# Altium project PROC154E3_SCH.PrjPcb (part 13 of 60)

## Sheet 22. SOC ANALOG POWER 1.SchDoc: SOC - ANALOG POWER 1
size 513 x 386 mm; Project: PROC154E2(001)_SK_AM69; Issue: 1.0; RevCode: E3; Page Create Date: March  8, 1995; Variant Name: Core Design; Schematic Page Number: 22; Page Number: 22; Page Size: C; Comment: MISTRAL_TITLEBLK_CSIZE_1; Page Count: 62; Schematic Page Count: 62; Name: PROC154E2 001 SK AM69; DsnPath: C:\Users\danie\Downloads\sprr466c\PROC154E3_RP\PROC154E3_SCH.DSN; SchematicName: SCHEMATIC1; PageName: 22. SOC ANALOG POWER 1; PageSize: C; TopSchematic: True
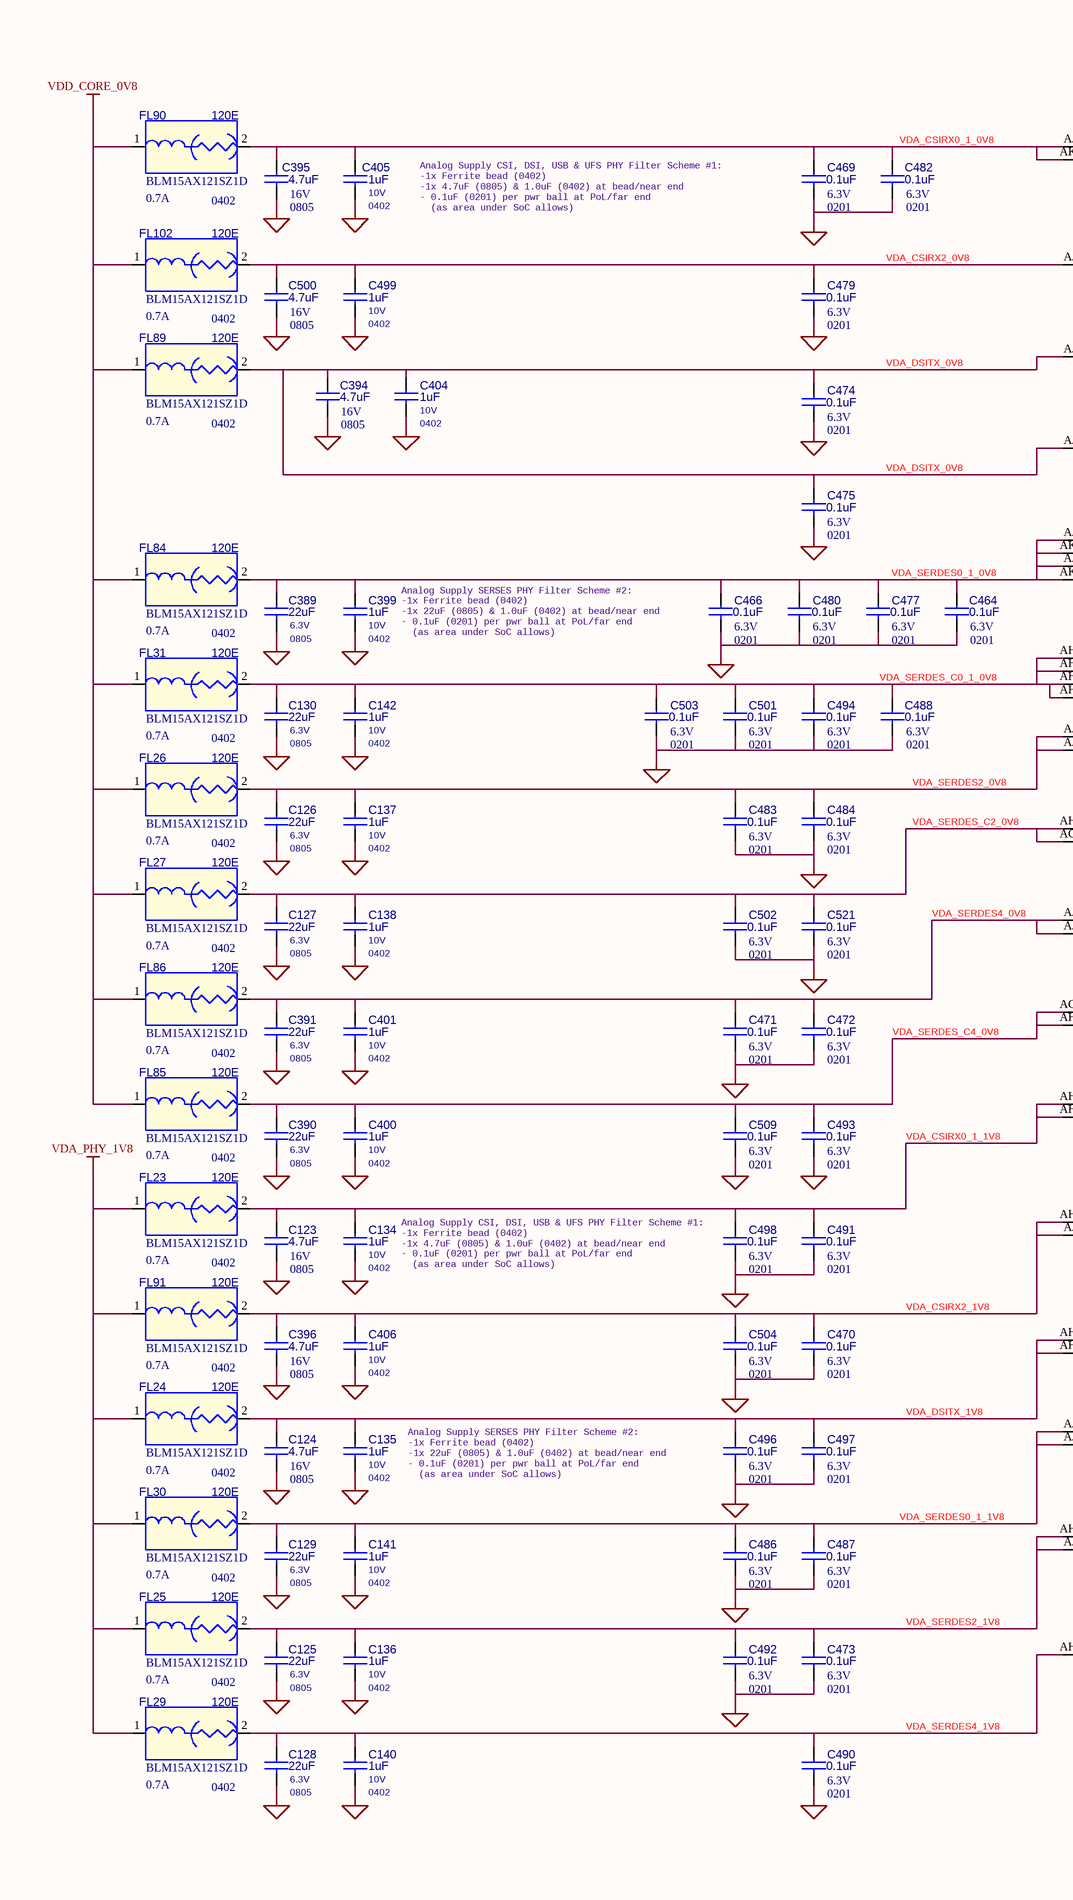
[diagram p32: 22. SOC ANALOG POWER 1.SchDoc, left]
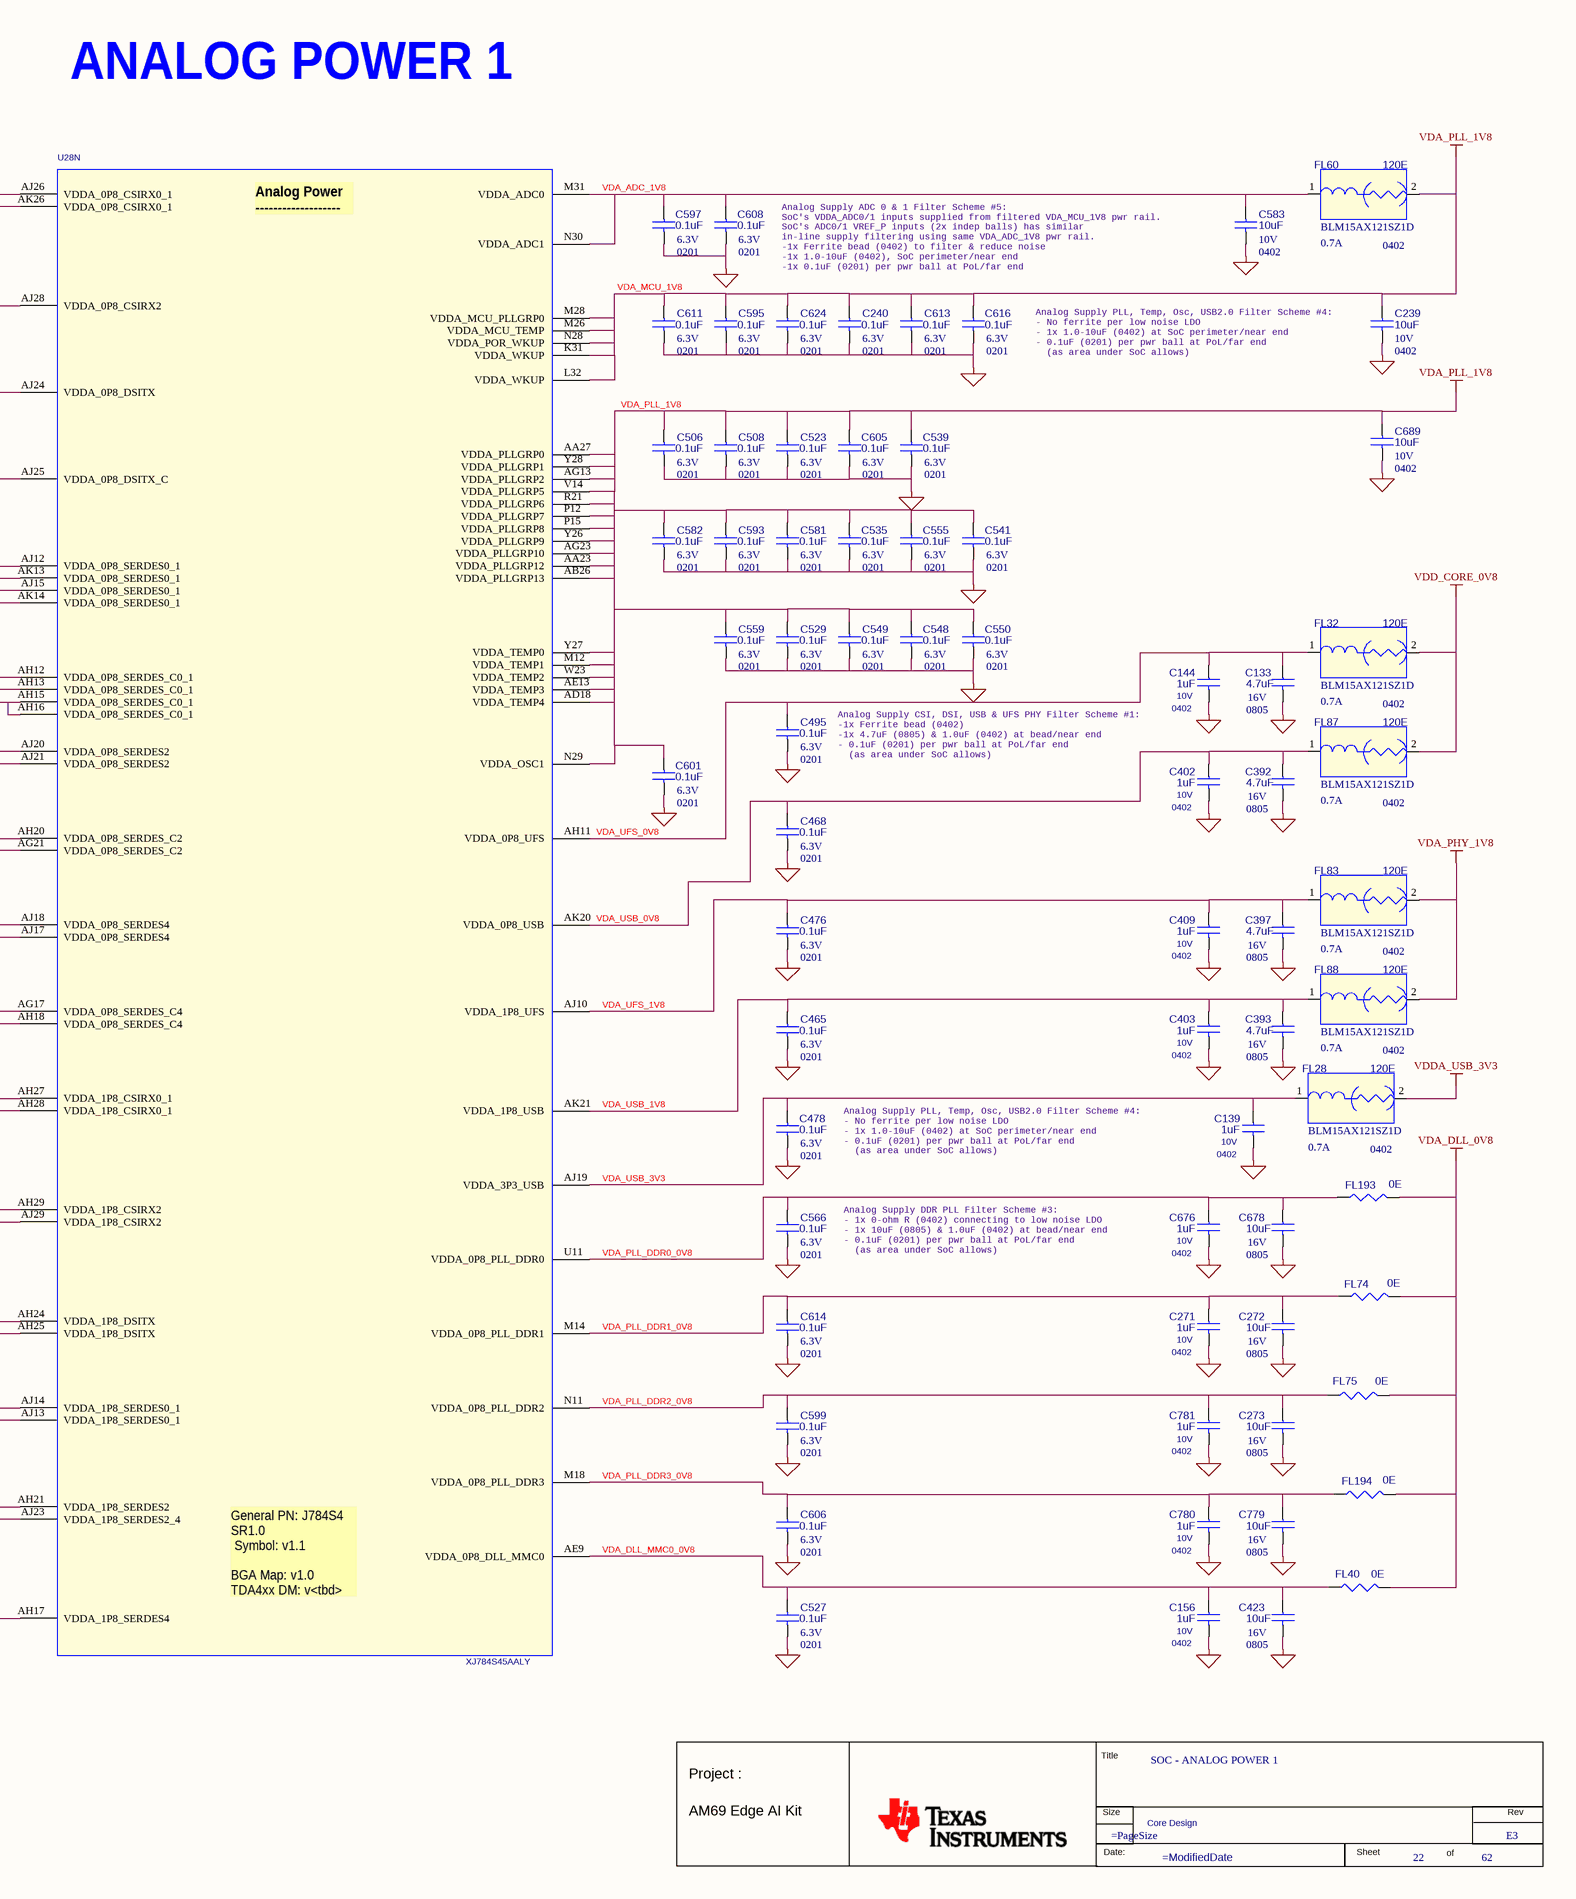
[diagram p33: 22. SOC ANALOG POWER 1.SchDoc, right]

### Parts
(Parts that share a designator on the sheet are numbered #1, #2 ... from top to bottom, then left to right.)
*#22  RevCode: E3  Title: SOC - ANALOG POWER 1  Page Number: 22  Page Count: 62  Variant Name: Core Design  (hidden comment: MISTRAL_TITLEBLK_CSIZE_1)  (graphical)
C123  4.7uF  Package: 0805  Voltage: 16V  [CAP0805_1-5]
C124  4.7uF  Package: 0805  Voltage: 16V  [CAP0805_1-5]
C125  22uF  Voltage: 6.3V  Package: 0805  [CAP0805_1-25]
C126  22uF  Package: 0805  Voltage: 6.3V  [CAP0805_1-25]
C127  22uF  Package: 0805  Voltage: 6.3V  [CAP0805_1-25]
C128  22uF  Package: 0805  Voltage: 6.3V  [CAP0805_1-25]
C129  22uF  Voltage: 6.3V  Package: 0805  [CAP0805_1-25]
C130  22uF  Package: 0805  Voltage: 6.3V  [CAP0805_1-25]
C133  4.7uF  Voltage: 16V  Package: 0805  [CAP0805_1-5]
C134  1uF  Voltage: 10V  Package: 0402  [CAP0402_0-75]
C135  1uF  Voltage: 10V  Package: 0402  [CAP0402_0-75]
C136  1uF  Package: 0402  Voltage: 10V  [CAP0402_0-75]
C137  1uF  Package: 0402  Voltage: 10V  [CAP0402_0-75]
C138  1uF  Voltage: 10V  Package: 0402  [CAP0402_0-75]
C139  1uF  Voltage: 10V  Package: 0402  [CAP0402_0-75]
C140  1uF  Voltage: 10V  Package: 0402  [CAP0402_0-75]
C141  1uF  Package: 0402  Voltage: 10V  [CAP0402_0-75]
C142  1uF  Package: 0402  Voltage: 10V  [CAP0402_0-75]
C144  1uF  Package: 0402  Voltage: 10V  [CAP0402_0-75]
C156  1uF  Voltage: 10V  Package: 0402  [CAP0402_0-75]
C239  10uF  Package: 0402  Voltage: 10V  [CAP0402_0-75]
C240  0.1uF  Voltage: 6.3V  Package: 0201  [CAP0201_0-5]
C271  1uF  Voltage: 10V  Package: 0402  [CAP0402_0-75]
C272  10uF  Voltage: 16V  Package: 0805  [CAP0805_1-5]
C273  10uF  Voltage: 16V  Package: 0805  [CAP0805_1-5]
C389  22uF  Package: 0805  Voltage: 6.3V  [CAP0805_1-25]
C390  22uF  Voltage: 6.3V  Package: 0805  [CAP0805_1-25]
C391  22uF  Package: 0805  Voltage: 6.3V  [CAP0805_1-25]
C392  4.7uF  Voltage: 16V  Package: 0805  [CAP0805_1-5]
C393  4.7uF  Voltage: 16V  Package: 0805  [CAP0805_1-5]
C394  4.7uF  Package: 0805  Voltage: 16V  [CAP0805_1-5]
C395  4.7uF  Voltage: 16V  Package: 0805  [CAP0805_1-5]
C396  4.7uF  Voltage: 16V  Package: 0805  [CAP0805_1-5]
C397  4.7uF  Voltage: 16V  Package: 0805  [CAP0805_1-5]
C399  1uF  Voltage: 10V  Package: 0402  [CAP0402_0-75]
C400  1uF  Package: 0402  Voltage: 10V  [CAP0402_0-75]
C401  1uF  Voltage: 10V  Package: 0402  [CAP0402_0-75]
C402  1uF  Package: 0402  Voltage: 10V  [CAP0402_0-75]
C403  1uF  Package: 0402  Voltage: 10V  [CAP0402_0-75]
C404  1uF  Package: 0402  Voltage: 10V  [CAP0402_0-75]
C405  1uF  Package: 0402  Voltage: 10V  [CAP0402_0-75]
C406  1uF  Package: 0402  Voltage: 10V  [CAP0402_0-75]
C409  1uF  Package: 0402  Voltage: 10V  [CAP0402_0-75]
C423  10uF  Voltage: 16V  Package: 0805  [CAP0805_1-5]
C464  0.1uF  Package: 0201  Voltage: 6.3V  [CAP0201_0-5]
C465  0.1uF  Voltage: 6.3V  Package: 0201  [CAP0201_0-5]
C466  0.1uF  Package: 0201  Voltage: 6.3V  [CAP0201_0-5]
C468  0.1uF  Voltage: 6.3V  Package: 0201  [CAP0201_0-5]
C469  0.1uF  Voltage: 6.3V  Package: 0201  [CAP0201_0-5]
C470  0.1uF  Voltage: 6.3V  Package: 0201  [CAP0201_0-5]
C471  0.1uF  Voltage: 6.3V  Package: 0201  [CAP0201_0-5]
C472  0.1uF  Package: 0201  Voltage: 6.3V  [CAP0201_0-5]
C473  0.1uF  Voltage: 6.3V  Package: 0201  [CAP0201_0-5]
C474  0.1uF  Package: 0201  Voltage: 6.3V  [CAP0201_0-5]
C475  0.1uF  Voltage: 6.3V  Package: 0201  [CAP0201_0-5]
C476  0.1uF  Voltage: 6.3V  Package: 0201  [CAP0201_0-5]
C477  0.1uF  Voltage: 6.3V  Package: 0201  [CAP0201_0-5]
C478  0.1uF  Package: 0201  Voltage: 6.3V  [CAP0201_0-5]
C479  0.1uF  Voltage: 6.3V  Package: 0201  [CAP0201_0-5]
C480  0.1uF  Package: 0201  Voltage: 6.3V  [CAP0201_0-5]
C482  0.1uF  Voltage: 6.3V  Package: 0201  [CAP0201_0-5]
C483  0.1uF  Package: 0201  Voltage: 6.3V  [CAP0201_0-5]
C484  0.1uF  Package: 0201  Voltage: 6.3V  [CAP0201_0-5]
C486  0.1uF  Voltage: 6.3V  Package: 0201  [CAP0201_0-5]
C487  0.1uF  Voltage: 6.3V  Package: 0201  [CAP0201_0-5]
C488  0.1uF  Voltage: 6.3V  Package: 0201  [CAP0201_0-5]
C490  0.1uF  Voltage: 6.3V  Package: 0201  [CAP0201_0-5]
C491  0.1uF  Package: 0201  Voltage: 6.3V  [CAP0201_0-5]
C492  0.1uF  Voltage: 6.3V  Package: 0201  [CAP0201_0-5]
C493  0.1uF  Voltage: 6.3V  Package: 0201  [CAP0201_0-5]
C494  0.1uF  Package: 0201  Voltage: 6.3V  [CAP0201_0-5]
C495  0.1uF  Voltage: 6.3V  Package: 0201  [CAP0201_0-5]
C496  0.1uF  Package: 0201  Voltage: 6.3V  [CAP0201_0-5]
C497  0.1uF  Voltage: 6.3V  Package: 0201  [CAP0201_0-5]
C498  0.1uF  Voltage: 6.3V  Package: 0201  [CAP0201_0-5]
C499  1uF  Package: 0402  Voltage: 10V  [CAP0402_0-75]
C500  4.7uF  Package: 0805  Voltage: 16V  [CAP0805_1-5]
C501  0.1uF  Voltage: 6.3V  Package: 0201  [CAP0201_0-5]
C502  0.1uF  Package: 0201  Voltage: 6.3V  [CAP0201_0-5]
C503  0.1uF  Voltage: 6.3V  Package: 0201  [CAP0201_0-5]
C504  0.1uF  Package: 0201  Voltage: 6.3V  [CAP0201_0-5]
C506  0.1uF  Voltage: 6.3V  Package: 0201  [CAP0201_0-5]
C508  0.1uF  Voltage: 6.3V  Package: 0201  [CAP0201_0-5]
C509  0.1uF  Package: 0201  Voltage: 6.3V  [CAP0201_0-5]
C521  0.1uF  Voltage: 6.3V  Package: 0201  [CAP0201_0-5]
C523  0.1uF  Voltage: 6.3V  Package: 0201  [CAP0201_0-5]
C527  0.1uF  Package: 0201  Voltage: 6.3V  [CAP0201_0-5]
C529  0.1uF  Package: 0201  Voltage: 6.3V  [CAP0201_0-5]
C535  0.1uF  Package: 0201  Voltage: 6.3V  [CAP0201_0-5]
C539  0.1uF  Package: 0201  Voltage: 6.3V  [CAP0201_0-5]
C541  0.1uF  Voltage: 6.3V  Package: 0201  [CAP0201_0-5]
C548  0.1uF  Package: 0201  Voltage: 6.3V  [CAP0201_0-5]
C549  0.1uF  Voltage: 6.3V  Package: 0201  [CAP0201_0-5]
C550  0.1uF  Voltage: 6.3V  Package: 0201  [CAP0201_0-5]
C555  0.1uF  Package: 0201  Voltage: 6.3V  [CAP0201_0-5]
C559  0.1uF  Voltage: 6.3V  Package: 0201  [CAP0201_0-5]
C566  0.1uF  Package: 0201  Voltage: 6.3V  [CAP0201_0-5]
C581  0.1uF  Voltage: 6.3V  Package: 0201  [CAP0201_0-5]
C582  0.1uF  Package: 0201  Voltage: 6.3V  [CAP0201_0-5]
C583  10uF  Package: 0402  Voltage: 10V  [CAP0402_0-75]
C593  0.1uF  Package: 0201  Voltage: 6.3V  [CAP0201_0-5]
C595  0.1uF  Voltage: 6.3V  Package: 0201  [CAP0201_0-5]
C597  0.1uF  Package: 0201  Voltage: 6.3V  [CAP0201_0-5]
C599  0.1uF  Package: 0201  Voltage: 6.3V  [CAP0201_0-5]
C601  0.1uF  Voltage: 6.3V  Package: 0201  [CAP0201_0-5]
C605  0.1uF  Package: 0201  Voltage: 6.3V  [CAP0201_0-5]
C606  0.1uF  Voltage: 6.3V  Package: 0201  [CAP0201_0-5]
C608  0.1uF  Package: 0201  Voltage: 6.3V  [CAP0201_0-5]
C611  0.1uF  Package: 0201  Voltage: 6.3V  [CAP0201_0-5]
C613  0.1uF  Package: 0201  Voltage: 6.3V  [CAP0201_0-5]
C614  0.1uF  Package: 0201  Voltage: 6.3V  [CAP0201_0-5]
C616  0.1uF  Voltage: 6.3V  Package: 0201  [CAP0201_0-5]
C624  0.1uF  Package: 0201  Voltage: 6.3V  [CAP0201_0-5]
C676  1uF  Voltage: 10V  Package: 0402  [CAP0402_0-75]
C678  10uF  Voltage: 16V  Package: 0805  [CAP0805_1-5]
C689  10uF  Package: 0402  Voltage: 10V  [CAP0402_0-75]
C779  10uF  Voltage: 16V  Package: 0805  [CAP0805_1-5]
C780  1uF  Package: 0402  Voltage: 10V  [CAP0402_0-75]
C781  1uF  Voltage: 10V  Package: 0402  [CAP0402_0-75]
FL23  120E  Mfr_part_number: BLM15AX121SZ1D  Package: 0402  SAT Current: 0.7A  [EMIFIL_BLM15A_0402_0-6]
FL24  120E  SAT Current: 0.7A  Package: 0402  Mfr_part_number: BLM15AX121SZ1D  [EMIFIL_BLM15A_0402_0-6]
FL25  120E  Mfr_part_number: BLM15AX121SZ1D  Package: 0402  SAT Current: 0.7A  [EMIFIL_BLM15A_0402_0-6]
FL26  120E  Mfr_part_number: BLM15AX121SZ1D  Package: 0402  SAT Current: 0.7A  [EMIFIL_BLM15A_0402_0-6]
FL27  120E  Mfr_part_number: BLM15AX121SZ1D  Package: 0402  SAT Current: 0.7A  [EMIFIL_BLM15A_0402_0-6]
FL28  120E  Mfr_part_number: BLM15AX121SZ1D  Package: 0402  SAT Current: 0.7A  [EMIFIL_BLM15A_0402_0-6]
FL29  120E  Mfr_part_number: BLM15AX121SZ1D  Package: 0402  SAT Current: 0.7A  [EMIFIL_BLM15A_0402_0-6]
FL30  120E  SAT Current: 0.7A  Package: 0402  Mfr_part_number: BLM15AX121SZ1D  [EMIFIL_BLM15A_0402_0-6]
FL31  120E  SAT Current: 0.7A  Package: 0402  Mfr_part_number: BLM15AX121SZ1D  [EMIFIL_BLM15A_0402_0-6]
FL32  120E  SAT Current: 0.7A  Package: 0402  Mfr_part_number: BLM15AX121SZ1D  [EMIFIL_BLM15A_0402_0-6]
FL40  0E  [RES0402_0-5]
FL60  120E  SAT Current: 0.7A  Package: 0402  Mfr_part_number: BLM15AX121SZ1D  [EMIFIL_BLM15A_0402_0-6]
FL74  0E  [RES0402_0-5]
FL75  0E  [RES0402_0-5]
FL83  120E  Mfr_part_number: BLM15AX121SZ1D  Package: 0402  SAT Current: 0.7A  [EMIFIL_BLM15A_0402_0-6]
FL84  120E  SAT Current: 0.7A  Package: 0402  Mfr_part_number: BLM15AX121SZ1D  [EMIFIL_BLM15A_0402_0-6]
FL85  120E  SAT Current: 0.7A  Package: 0402  Mfr_part_number: BLM15AX121SZ1D  [EMIFIL_BLM15A_0402_0-6]
FL86  120E  SAT Current: 0.7A  Package: 0402  Mfr_part_number: BLM15AX121SZ1D  [EMIFIL_BLM15A_0402_0-6]
FL87  120E  SAT Current: 0.7A  Package: 0402  Mfr_part_number: BLM15AX121SZ1D  [EMIFIL_BLM15A_0402_0-6]
FL88  120E  Mfr_part_number: BLM15AX121SZ1D  Package: 0402  SAT Current: 0.7A  [EMIFIL_BLM15A_0402_0-6]
FL89  120E  SAT Current: 0.7A  Package: 0402  Mfr_part_number: BLM15AX121SZ1D  [EMIFIL_BLM15A_0402_0-6]
FL90  120E  SAT Current: 0.7A  Package: 0402  Mfr_part_number: BLM15AX121SZ1D  [EMIFIL_BLM15A_0402_0-6]
FL91  120E  Mfr_part_number: BLM15AX121SZ1D  Package: 0402  SAT Current: 0.7A  [EMIFIL_BLM15A_0402_0-6]
FL102  120E  Mfr_part_number: BLM15AX121SZ1D  Package: 0402  SAT Current: 0.7A  [EMIFIL_BLM15A_0402_0-6]
FL193  0E  [RES0402_0-5]
FL194  0E  [RES0402_0-5]
U28  XJ784S45AALY  [BGA1414_31-49_1230X1230_2-7]  (part N of 26)

### Nets
DGND: C123.2 C124.2 C125.2 C126.2 C127.2 C128.2 C129.2 C130.2 C133.2 C134.2 C135.2 C136.2 C137.2 C138.2 C139.2 C140.2 C141.2 C142.2 C144.2 C156.2 C239.2 C240.2 C271.2 C272.2 C273.2 C389.2 C390.2 C391.2 C392.2 C393.2 C394.2 C395.2 C396.2 C397.2 C399.2 C400.2 C401.2 C402.2 C403.2 C404.2 C405.2 C406.2 C409.2 C423.2 C464.2 C465.2 C466.2 C468.2 C469.2 C470.2 C471.2 C472.2 C473.2 C474.2 C475.2 C476.2 C477.2 C478.2 C479.2 C480.2 C482.2 C483.2 C484.2 C486.2 C487.2 C488.2 C490.2 C491.2 C492.2 C493.2 C494.2 C495.2 C496.2 C497.2 C498.2 C499.2 C500.2 C501.2 C502.2 C503.2 C504.2 C506.2 C508.2 C509.2 C521.2 C523.2 C527.2 C529.2 C535.2 C539.2 C541.2 C548.2 C549.2 C550.2 C555.2 C559.2 C566.2 C581.2 C582.2 C583.2 C593.2 C595.2 C597.2 C599.2 C601.2 C605.2 C606.2 C608.2 C611.2 C613.2 C614.2 C616.2 C624.2 C676.2 C678.2 C689.2 C779.2 C780.2 C781.2  [project net VDD_CPU_HCPS_GOSNS]
VDA_DLL_0V8: FL40.2 FL74.2 FL75.2 FL193.2 FL194.2
VDA_MCU_1V8: C239.1 C240.1 C506.1 C508.1 C523.1 C529.1 C535.1 C539.1 C541.1 C548.1 C549.1 C550.1 C555.1 C559.1 C581.1 C582.1 C593.1 C595.1 C601.1 C605.1 C611.1 C613.1 C616.1 C624.1 C689.1 FL60.2 U28.AA23(VDDA_PLLGRP12) U28.AA27(VDDA_PLLGRP0) U28.AB26(VDDA_PLLGRP13) U28.AD18(VDDA_TEMP4) U28.AE13(VDDA_TEMP3) U28.AG13(VDDA_PLLGRP2) U28.AG23(VDDA_PLLGRP10) U28.K31(VDDA_WKUP) U28.L32(VDDA_WKUP) U28.M12(VDDA_TEMP1) U28.M26(VDDA_MCU_TEMP) U28.M28(VDDA_MCU_PLLGRP0) U28.N28(VDDA_POR_WKUP) U28.N29(VDDA_OSC1) U28.P12(VDDA_PLLGRP7) U28.P15(VDDA_PLLGRP8) U28.R21(VDDA_PLLGRP6) U28.V14(VDDA_PLLGRP5) U28.W23(VDDA_TEMP2) U28.Y26(VDDA_PLLGRP9) U28.Y27(VDDA_TEMP0) U28.Y28(VDDA_PLLGRP1)  [also labelled VDA_PLL_1V8]
VDA_PHY_1V8: FL23.1 FL24.1 FL25.1 FL29.1 FL30.1 FL83.2 FL88.2 FL91.1
VDD_CORE_0V8: FL26.1 FL27.1 FL31.1 FL32.2 FL84.1 FL85.1 FL86.1 FL87.2 FL89.1 FL90.1 FL102.1  [project net VDD_WAKE0]
VDDA_USB_3V3: FL28.2
VDA_ADC_1V8: C583.1 C597.1 C608.1 FL60.1 U28.M31(VDDA_ADC0) U28.N30(VDDA_ADC1)
VDA_CSIRX0_1_0V8: C395.1 C405.1 C469.1 C482.1 FL90.2 U28.AJ26(VDDA_0P8_CSIRX0_1) U28.AK26(VDDA_0P8_CSIRX0_1)
VDA_CSIRX0_1_1V8: C123.1 C134.1 C491.1 C498.1 FL23.2 U28.AH27(VDDA_1P8_CSIRX0_1) U28.AH28(VDDA_1P8_CSIRX0_1)
VDA_CSIRX2_0V8: C479.1 C499.1 C500.1 FL102.2 U28.AJ28(VDDA_0P8_CSIRX2)
VDA_CSIRX2_1V8: C396.1 C406.1 C470.1 C504.1 FL91.2 U28.AH29(VDDA_1P8_CSIRX2) U28.AJ29(VDDA_1P8_CSIRX2)
VDA_DLL_MMC0_0V8: C156.1 C423.1 C527.1 FL40.1 U28.AE9(VDDA_0P8_DLL_MMC0)
VDA_DSITX_0V8: C394.1 C404.1 C474.1 C475.1 FL89.2 U28.AJ24(VDDA_0P8_DSITX) U28.AJ25(VDDA_0P8_DSITX_C)
VDA_DSITX_1V8: C124.1 C135.1 C496.1 C497.1 FL24.2 U28.AH24(VDDA_1P8_DSITX) U28.AH25(VDDA_1P8_DSITX)
VDA_PLL_DDR0_0V8: C566.1 C676.1 C678.1 FL193.1 U28.U11(VDDA_0P8_PLL_DDR0)
VDA_PLL_DDR1_0V8: C271.1 C272.1 C614.1 FL74.1 U28.M14(VDDA_0P8_PLL_DDR1)
VDA_PLL_DDR2_0V8: C273.1 C599.1 C781.1 FL75.1 U28.N11(VDDA_0P8_PLL_DDR2)
VDA_PLL_DDR3_0V8: C606.1 C779.1 C780.1 FL194.1 U28.M18(VDDA_0P8_PLL_DDR3)
VDA_SERDES0_1_0V8: C389.1 C399.1 C464.1 C466.1 C477.1 C480.1 FL84.2 U28.AJ12(VDDA_0P8_SERDES0_1) U28.AJ15(VDDA_0P8_SERDES0_1) U28.AK13(VDDA_0P8_SERDES0_1) U28.AK14(VDDA_0P8_SERDES0_1)
VDA_SERDES0_1_1V8: C129.1 C141.1 C486.1 C487.1 FL30.2 U28.AJ13(VDDA_1P8_SERDES0_1) U28.AJ14(VDDA_1P8_SERDES0_1)
VDA_SERDES2_0V8: C126.1 C137.1 C483.1 C484.1 FL26.2 U28.AJ20(VDDA_0P8_SERDES2) U28.AJ21(VDDA_0P8_SERDES2)
VDA_SERDES2_1V8: C125.1 C136.1 C473.1 C492.1 FL25.2 U28.AH21(VDDA_1P8_SERDES2) U28.AJ23(VDDA_1P8_SERDES2_4)
VDA_SERDES4_0V8: C391.1 C401.1 C471.1 C472.1 FL86.2 U28.AJ17(VDDA_0P8_SERDES4) U28.AJ18(VDDA_0P8_SERDES4)
VDA_SERDES4_1V8: C128.1 C140.1 C490.1 FL29.2 U28.AH17(VDDA_1P8_SERDES4)
VDA_SERDES_C0_1_0V8: C130.1 C142.1 C488.1 C494.1 C501.1 C503.1 FL31.2 U28.AH12(VDDA_0P8_SERDES_C0_1) U28.AH13(VDDA_0P8_SERDES_C0_1) U28.AH15(VDDA_0P8_SERDES_C0_1) U28.AH16(VDDA_0P8_SERDES_C0_1)
VDA_SERDES_C2_0V8: C127.1 C138.1 C502.1 C521.1 FL27.2 U28.AG21(VDDA_0P8_SERDES_C2) U28.AH20(VDDA_0P8_SERDES_C2)
VDA_SERDES_C4_0V8: C390.1 C400.1 C493.1 C509.1 FL85.2 U28.AG17(VDDA_0P8_SERDES_C4) U28.AH18(VDDA_0P8_SERDES_C4)
VDA_UFS_0V8: C133.1 C144.1 C495.1 FL32.1 U28.AH11(VDDA_0P8_UFS)
VDA_UFS_1V8: C397.1 C409.1 C476.1 FL83.1 U28.AJ10(VDDA_1P8_UFS)
VDA_USB_0V8: C392.1 C402.1 C468.1 FL87.1 U28.AK20(VDDA_0P8_USB)
VDA_USB_1V8: C393.1 C403.1 C465.1 FL88.1 U28.AK21(VDDA_1P8_USB)
VDA_USB_3V3: C139.1 C478.1 FL28.1 U28.AJ19(VDDA_3P3_USB)

### Notes on the sheet
- ANALOG POWER 1
- (near C469) Analog Supply CSI, DSI, USB & UFS PHY Filter Scheme #1:
  -1x Ferrite bead (0402)
  -1x 4.7uF (0805) & 1.0uF (0402) at bead/near end
  - 0.1uF (0201) per pwr ball at PoL/far end
  (as area under SoC allows)
- Analog Supply ADC 0 & 1 Filter Scheme #5:
  SoC's VDDA_ADC0/1 inputs supplied from filtered VDA_MCU_1V8 pwr rail.
  SoC's ADC0/1 VREF_P inputs (2x indep balls) has similar
  in-line supply filtering using same VDA_ADC_1V8 pwr rail.
  -1x Ferrite bead (0402) to filter & reduce noise
  -1x 1.0-10uF (0402), SoC perimeter/near end
  -1x 0.1uF (0201) per pwr ball at PoL/far end
- (near C239) Analog Supply PLL, Temp, Osc, USB2.0 Filter Scheme #4:
  - No ferrite per low noise LDO
  - 1x 1.0-10uF (0402) at SoC perimeter/near end
  - 0.1uF (0201) per pwr ball at PoL/far end
  (as area under SoC allows)
- (near C466) Analog Supply SERSES PHY Filter Scheme #2:
  -1x Ferrite bead (0402)
  -1x 22uF (0805) & 1.0uF (0402) at bead/near end
  - 0.1uF (0201) per pwr ball at PoL/far end
  (as area under SoC allows)
- Analog Supply CSI, DSI, USB & UFS PHY Filter Scheme #1:
  -1x Ferrite bead (0402)
  -1x 4.7uF (0805) & 1.0uF (0402) at bead/near end
  - 0.1uF (0201) per pwr ball at PoL/far end
  (as area under SoC allows)
- Analog Supply PLL, Temp, Osc, USB2.0 Filter Scheme #4:
  - No ferrite per low noise LDO
  - 1x 1.0-10uF (0402) at SoC perimeter/near end
  - 0.1uF (0201) per pwr ball at PoL/far end
  (as area under SoC allows)
- (near C498) Analog Supply CSI, DSI, USB & UFS PHY Filter Scheme #1:
  -1x Ferrite bead (0402)
  -1x 4.7uF (0805) & 1.0uF (0402) at bead/near end
  - 0.1uF (0201) per pwr ball at PoL/far end
  (as area under SoC allows)
- Analog Supply DDR PLL Filter Scheme #3:
  - 1x 0-ohm R (0402) connecting to low noise LDO
  - 1x 10uF (0805) & 1.0uF (0402) at bead/near end
  - 0.1uF (0201) per pwr ball at PoL/far end
  (as area under SoC allows)
- (near C496) Analog Supply SERSES PHY Filter Scheme #2:
  -1x Ferrite bead (0402)
  -1x 22uF (0805) & 1.0uF (0402) at bead/near end
  - 0.1uF (0201) per pwr ball at PoL/far end
  (as area under SoC allows)
- (in symbol J7AHPSoC-EVM_BGA1414, part N) Analog Power / -------------------; General PN: J784S4 / SR1.0 / Symbol: v1.1 / BGA Map: v1.0 / TDA4xx DM: v<tbd>
- (in symbol MISTRAL_TITLEBLK_CSIZE_1) Title; Project :; Size; Rev; AM69 Edge AI Kit; Date:; Sheet; of